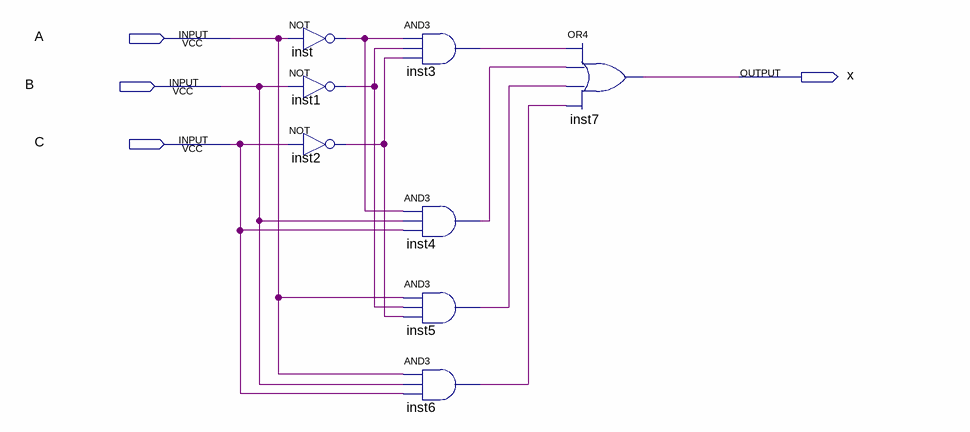
[diagram p0: schematic sheet]
// Quartus schematic led.bdf as structural Verilog: 8 symbols, 4 pins
module led (
  input  A,
  input  B,
  input  C,
  output x
);

  wire inst1_out, inst2_out, inst3_out, inst4_out, inst5_out, inst6_out, inst_out;

  not inst (inst_out, A);
  not inst1 (inst1_out, B);
  not inst2 (inst2_out, C);
  and inst3 (inst3_out, inst_out, inst1_out, inst2_out);
  and inst4 (inst4_out, inst_out, B, C);
  and inst5 (inst5_out, A, inst1_out, inst2_out);
  and inst6 (inst6_out, A, B, C);
  or inst7 (x, inst3_out, inst4_out, inst5_out, inst6_out);
endmodule
